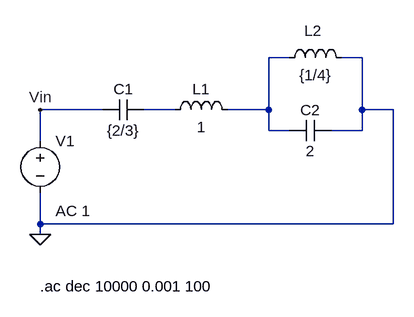
[diagram p0: schematic punto1a.asc]
punto1a.asc, the LTspice schematic file:
Version 4
SHEET 1 1000 760
WIRE 368 32 336 32
WIRE 480 32 448 32
WIRE 80 112 -16 112
WIRE 192 112 144 112
WIRE 336 112 336 32
WIRE 336 112 272 112
WIRE 480 112 480 32
WIRE 528 112 480 112
WIRE 336 144 336 112
WIRE 368 144 336 144
WIRE 480 144 480 112
WIRE 480 144 432 144
WIRE -16 160 -16 112
WIRE -16 288 -16 240
WIRE 528 288 528 112
WIRE 528 288 -16 288
WIRE -16 304 -16 288
FLAG -16 304 0
FLAG -16 112 Vin
SYMBOL cap 144 96 R90
WINDOW 0 0 32 VBottom 2
WINDOW 3 32 32 VTop 2
SYMATTR InstName C1
SYMATTR Value {2/3}
SYMBOL ind 176 128 R270
WINDOW 0 32 56 VTop 2
WINDOW 3 5 56 VBottom 2
SYMATTR InstName L1
SYMATTR Value 1
SYMATTR SpiceLine Rser=0 Rpar=1e30
SYMBOL ind 352 48 R270
WINDOW 0 42 52 VTop 2
WINDOW 3 5 56 VBottom 2
SYMATTR InstName L2
SYMATTR Value {1/4}
SYMATTR SpiceLine Rser=0 Rpar=1e30
SYMBOL cap 432 128 R90
WINDOW 0 0 32 VBottom 2
WINDOW 3 32 32 VTop 2
SYMATTR InstName C2
SYMATTR Value 2
SYMBOL voltage -16 144 R0
WINDOW 123 24 124 Left 2
WINDOW 39 0 0 Left 0
SYMATTR InstName V1
SYMATTR Value ""
SYMATTR Value2 AC 1
TEXT -16 384 Left 2 !.ac dec 10000 0.001 100

The netlist it stands for:
* punto1a.asc
C1 N002 Vin {2/3}
L1 N002 N001 1 Rser=0 Rpar=1e30
L2 N001 0 {1/4} Rser=0 Rpar=1e30
C2 0 N001 2
V1 Vin 0 AC 1
.ac dec 10000 0.001 100
.backanno
.end